# EAGLE design HighVBoard_01 (EAGLE 9.3.2)
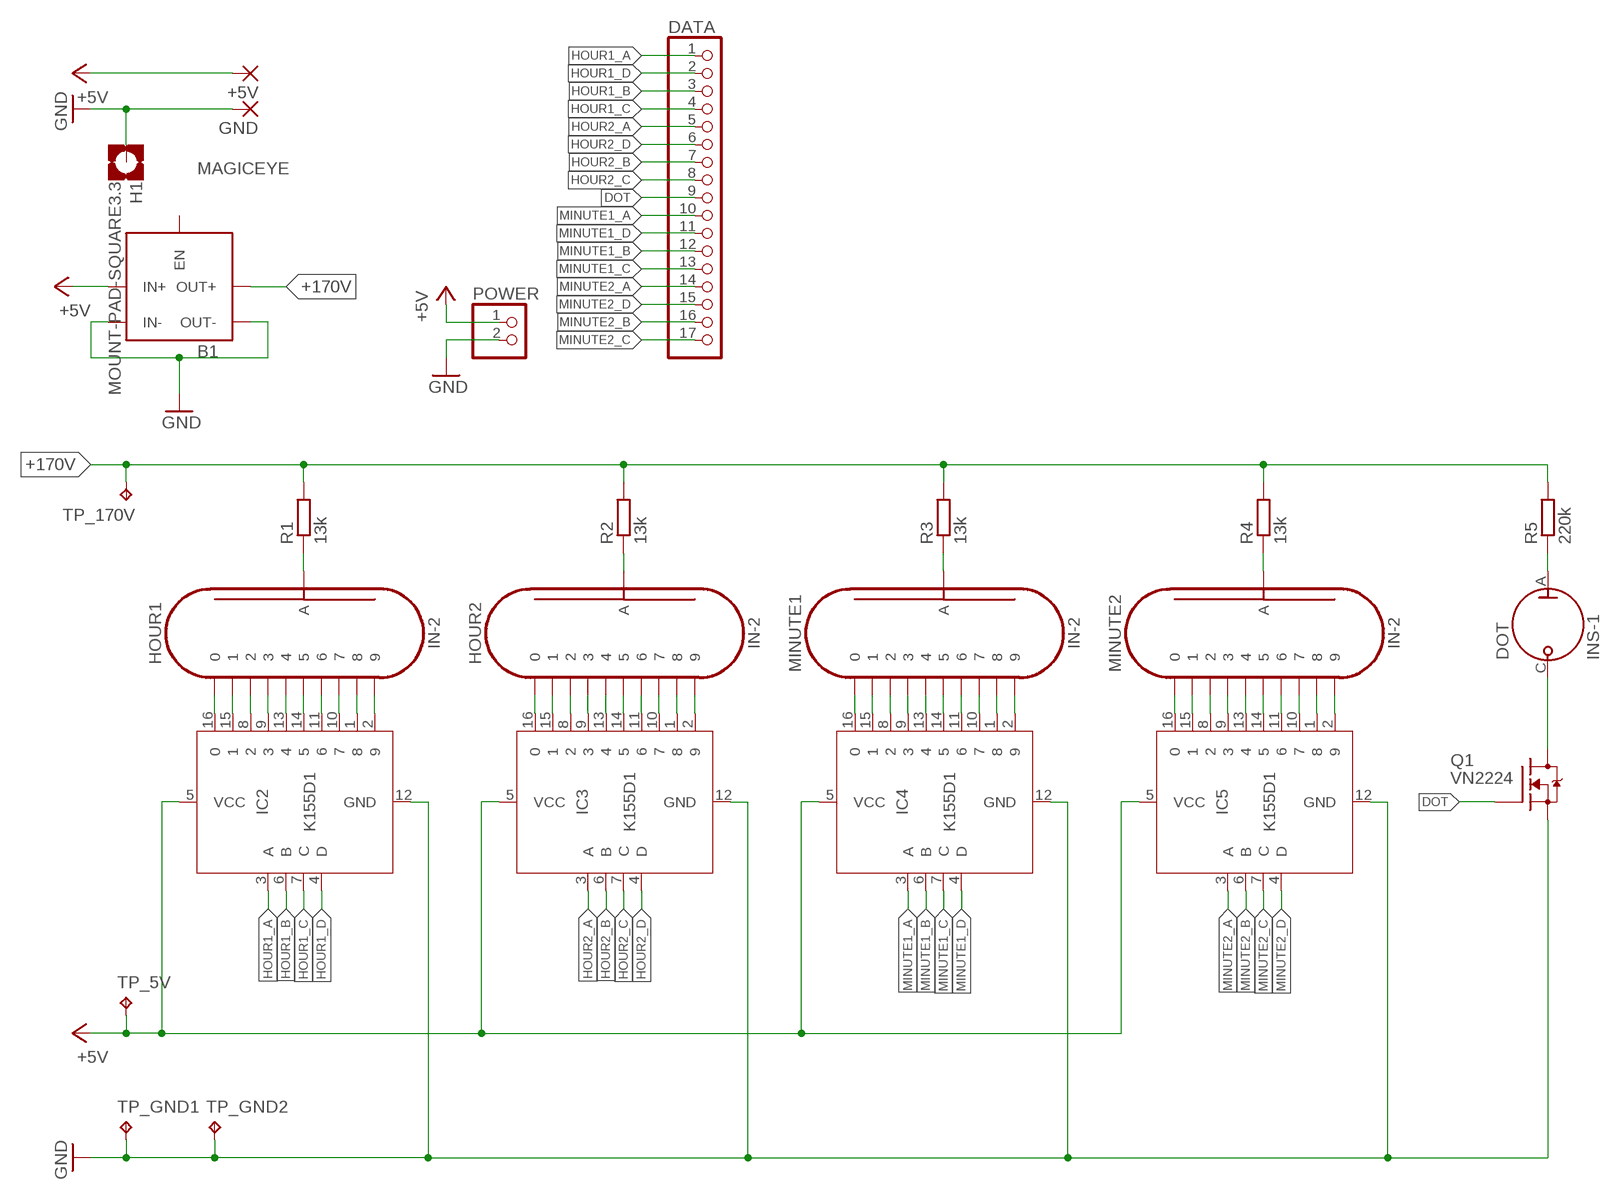
[diagram p0: schematic, sheet 1]

## Parts
+5V  2,15/1,0  [2,15/1,0]
B1  MAGICEYE  [MAGICEYE]
DATA  PINHD-1X17  [1X17]
DOT  INS-1  [INS-1]
GND  2,15/1,0  [2,15/1,0]
H1  MOUNT-PAD-SQUARE3.3  [3,3-PAD-SQUARE]
HOUR1  IN-2  [IN-2]
HOUR2  IN-2  [IN-2]
IC2  K155D1  [DIL16]
IC3  K155D1  [DIL16]
IC4  K155D1  [DIL16]
IC5  K155D1  [DIL16]
MINUTE1  IN-2  [IN-2]
MINUTE2  IN-2  [IN-2]
POWER  PINHD-1X2  [1X02]
Q1  VN2224  [TO92]
R1  13k  R-EU_0207/10  [0207/10]
R2  13k  R-EU_0207/10  [0207/10]
R3  13k  R-EU_0207/10  [0207/10]
R4  13k  R-EU_0207/10  [0207/10]
R5  220k  R-EU_0207/10  [0207/10]
TP_5V  TPPAD1-13  [P1-13]
TP_170V  TPPAD1-13  [P1-13]
TP_GND1  TPPAD1-13  [P1-13]
TP_GND2  TPPAD1-13  [P1-13]

## Nets
+5V [+5V]: +5V.1(P) B1.IN+ IC2.5(VCC) IC3.5(VCC) IC4.5(VCC) IC5.5(VCC) POWER.1 TP_5V.TP
+170V [+170V]: B1.OUT+ R1.2 R2.2 R3.2 R4.2 R5.2 TP_170V.TP
DOT: DATA.9 Q1.2(G)
GND [GND]: B1.IN- B1.OUT- GND.1(P) H1.B3,3(MOUNT) IC2.12(GND) IC3.12(GND) IC4.12(GND) IC5.12(GND) POWER.2 Q1.1(S) TP_GND1.TP TP_GND2.TP
HOUR1_A: DATA.1 IC2.3(A)
HOUR1_B: DATA.3 IC2.6(B)
HOUR1_C: DATA.4 IC2.7(C)
HOUR1_D: DATA.2 IC2.4(D)
HOUR2_A: DATA.5 IC3.3(A)
HOUR2_B: DATA.7 IC3.6(B)
HOUR2_C: DATA.8 IC3.7(C)
HOUR2_D: DATA.6 IC3.4(D)
MINUTE1_A: DATA.10 IC4.3(A)
MINUTE1_B: DATA.12 IC4.6(B)
MINUTE1_C: DATA.13 IC4.7(C)
MINUTE1_D: DATA.11 IC4.4(D)
MINUTE2_A: DATA.14 IC5.3(A)
MINUTE2_B: DATA.16 IC5.6(B)
MINUTE2_C: DATA.17 IC5.7(C)
MINUTE2_D: DATA.15 IC5.4(D)
N$1: DOT.C Q1.3(D)
N$7: HOUR1.0 IC2.16
N$10 [+170V]: HOUR1.1 IC2.15
N$11 [+170V]: HOUR1.2 IC2.8
N$12 [+170V]: HOUR1.3 IC2.9
N$13 [+170V]: HOUR1.4 IC2.13
N$14 [+170V]: HOUR1.5 IC2.14
N$15 [+170V]: HOUR1.6 IC2.11
N$16 [+170V]: HOUR1.7 IC2.10
N$17 [+170V]: HOUR1.8 IC2.1
N$18 [+170V]: HOUR1.9 IC2.2
N$19 [+170V]: HOUR1.A R1.1
N$20 [+170V]: HOUR2.0 IC3.16
N$21 [+170V]: HOUR2.1 IC3.15
N$22 [+170V]: HOUR2.2 IC3.8
N$23 [+170V]: HOUR2.3 IC3.9
N$24 [+170V]: HOUR2.4 IC3.13
N$25 [+170V]: HOUR2.5 IC3.14
N$26 [+170V]: HOUR2.6 IC3.11
N$27 [+170V]: HOUR2.7 IC3.10
N$28 [+170V]: HOUR2.8 IC3.1
N$29 [+170V]: HOUR2.9 IC3.2
N$30 [+170V]: HOUR2.A R2.1
N$31 [+170V]: IC4.16 MINUTE1.0
N$32 [+170V]: IC4.15 MINUTE1.1
N$33 [+170V]: IC4.8 MINUTE1.2
N$34 [+170V]: IC4.9 MINUTE1.3
N$35 [+170V]: IC4.13 MINUTE1.4
N$36 [+170V]: IC4.14 MINUTE1.5
N$37 [+170V]: IC4.11 MINUTE1.6
N$38 [+170V]: IC4.10 MINUTE1.7
N$39 [+170V]: IC4.1 MINUTE1.8
N$40 [+170V]: IC4.2 MINUTE1.9
N$41 [+170V]: MINUTE1.A R3.1
N$42 [+170V]: IC5.16 MINUTE2.0
N$43 [+170V]: IC5.15 MINUTE2.1
N$44 [+170V]: IC5.8 MINUTE2.2
N$45 [+170V]: IC5.9 MINUTE2.3
N$46 [+170V]: IC5.13 MINUTE2.4
N$47 [+170V]: IC5.14 MINUTE2.5
N$48 [+170V]: IC5.11 MINUTE2.6
N$49 [+170V]: IC5.10 MINUTE2.7
N$50 [+170V]: IC5.1 MINUTE2.8
N$51 [+170V]: IC5.2 MINUTE2.9
N$52 [+170V]: MINUTE2.A R4.1
N$55 [+170V]: DOT.A R5.1
Unconnected: B1.EN

## Library data of the parts
+5V GND = wirepad:2,15/1,0: THROUGH-HOLE PAD
B1 = Nixie:MAGICEYE
DATA = pinhead:PINHD-1X17: PIN HEADER
DOT = Nixie:INS-1
H1 = holes:MOUNT-PAD-SQUARE: MOUNTING PAD, square
HOUR1 HOUR2 MINUTE1 MINUTE2 = Nixie:IN-2
IC2-IC5 = Nixie:K155D1
POWER = pinhead:PINHD-1X2: PIN HEADER
Q1 = Nixie:VN2224
R1-R5 = resistor:R-EU_: RESISTOR, European symbol
TP_5V TP_170V TP_GND1 TP_GND2 = testpad:TP: Test pad

## Net classes
0 SIGNAL: width 0.203 mm, clearance 0.203 mm
2 +5V: width 0.406 mm, clearance 0.203 mm
3 +170V: width 0.203 mm, clearance 0.406 mm
4 GND: clearance 0.203 mm

## Board
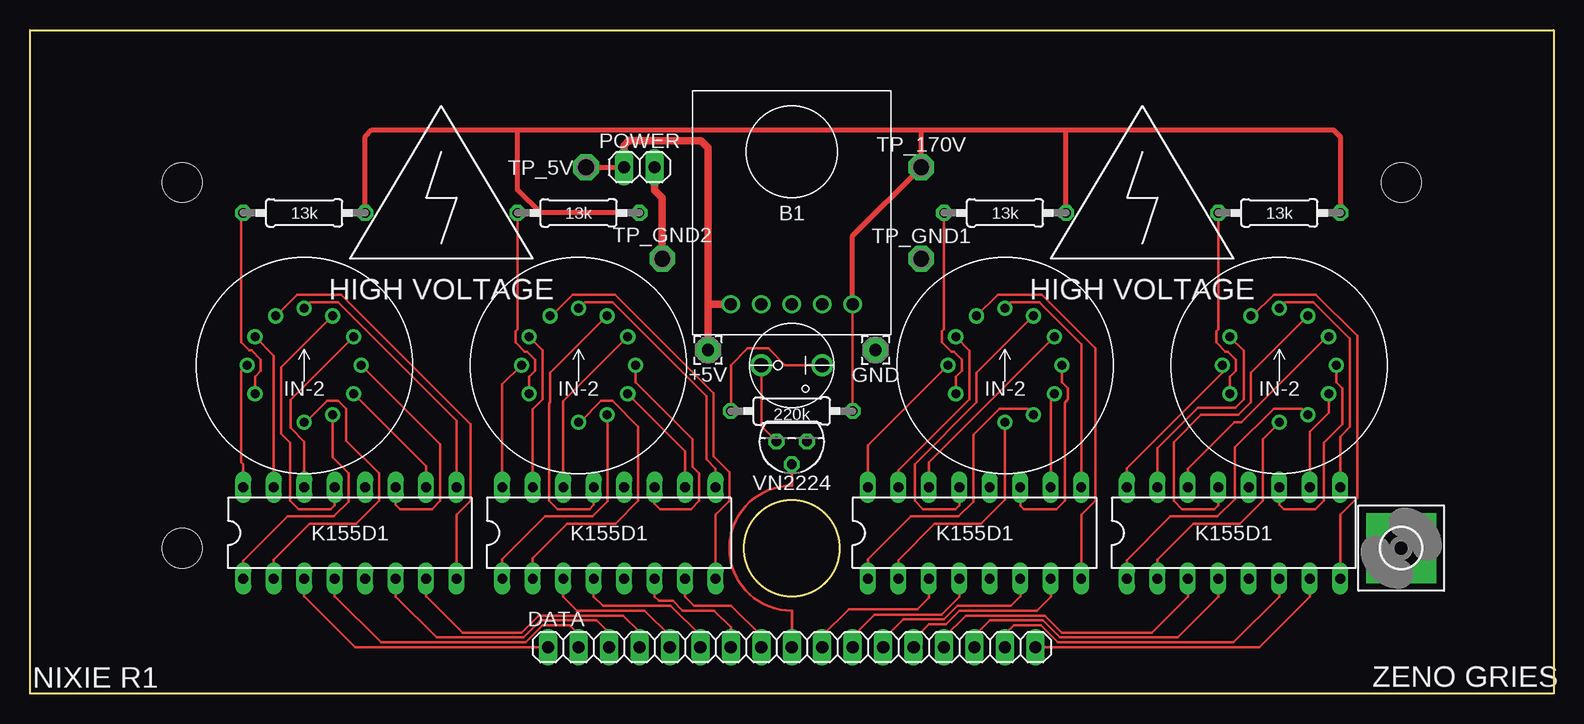
[diagram p1: board, top side]
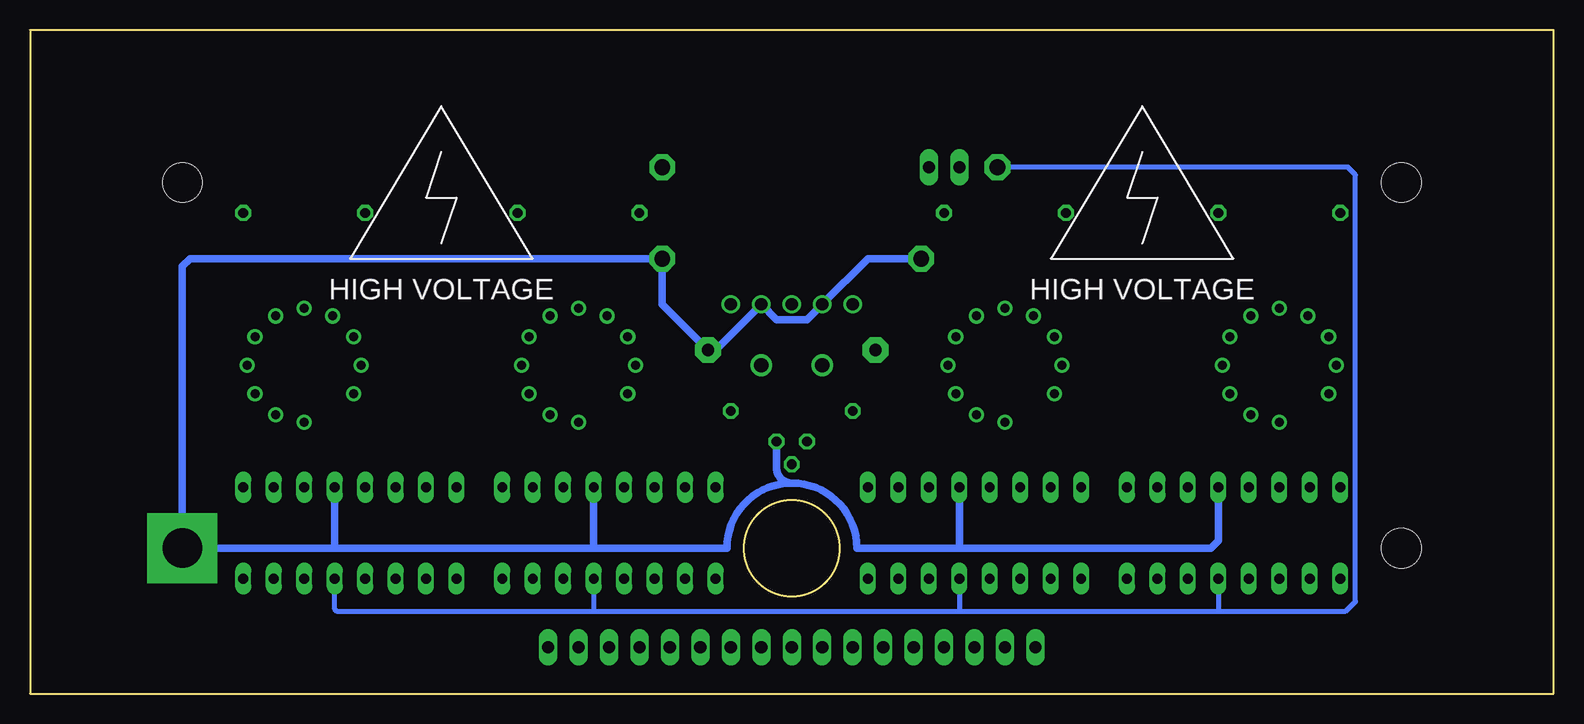
[diagram p2: board, bottom side, seen from below]

Size 127 x 55.31 mm. Coordinates in mm from the lower left corner, seen from the top.
Outline: 0,0 0,55.31 127,55.31 127,0 0,0
Outline: circle at 63.5,12.13 radius 4
Copper layers (1*16): Top 0.035mm / dielectric 1.5mm / Bottom 0.035mm
Design rules "default *": minimum track width 6mil, minimum drill 0.35mm, track to track 8mil, track to pad 8mil, pad to pad 8mil, via to via 8mil, smd to smd 6mil, copper to edge 40mil, drill to drill 6mil, minimum pad ring 10mil, minimum via ring 8mil, stop-mask expansion 4mil, vias tented up to drill 0mil, thermal gap 10mil
Holes 3.3 mm at 12.7,42.61 12.7,12.13 114.3,42.61

### Footprints (pad centres in the part's own frame; a part is rotated, then mirrored left to right if it is on the bottom)
2,15/1,0 = drill 1.016 pad 2.159 octagon: 1 0,0
MAGICEYE = drill 1.016: EN 0,0; IN+ -5.08,0; IN- -2.54,0; OUT+ 5.08,0; OUT- 2.54,0
1X17 = drill 1.016 long: 1 -20.32,0; 2 -17.78,0; 3 -15.24,0; 4 -12.7,0; 5 -10.16,0; 6 -7.62,0; 7 -5.08,0; 8 -2.54,0; 9 0,0; 10 2.54,0; 11 5.08,0; 12 7.62,0; 13 10.16,0; 14 12.7,0; 15 15.24,0; 16 17.78,0; 17 20.32,0
INS-1 = drill 1.2: A 0,2.54; C 0,-2.54
3,3-PAD-SQUARE = drill 3.3 pad 5.842 square: B3,3 0,0
IN-2 = drill 0.75: 0 -4.75,0; 1 -4.11,2.375; 2 -2.375,4.11; 3 0,4.75; 4 2.375,4.11; 5 4.11,2.375; 6 4.75,0; 7 4.11,-2.375; 8 2.375,-4.11; 9 0,-4.75; A -4.11,-2.375
DIL16 = drill 0.813 long: 1 -8.89,-3.81; 2 -6.35,-3.81; 3 -3.81,-3.81; 4 -1.27,-3.81; 5 1.27,-3.81; 6 3.81,-3.81; 7 6.35,-3.81; 8 8.89,-3.81; 9 8.89,3.81; 10 6.35,3.81; 11 3.81,3.81; 12 1.27,3.81; 13 -1.27,3.81; 14 -3.81,3.81; 15 -6.35,3.81; 16 -8.89,3.81
1X02 = drill 1.016 long: 1 -1.27,0; 2 1.27,0
TO92 = drill 0.813 octagon: 1 -1.27,0; 2 0,1.905; 3 1.27,0
0207/10 = drill 0.813 octagon: 1 -5.08,0; 2 5.08,0
P1-13 = drill 1.321 pad 2.159 octagon: TP 0,0

### Placement (x,y rotation side)
+5V  56.52,28.64 0 top
B1  63.5,32.45 0 top
DATA  63.5,3.88 0 top
DOT  63.5,27.37 270 top
GND  70.48,28.64 0 top
H1  114.3,12.13 0 top
HOUR1  22.86,27.37 0 top
HOUR2  45.72,27.37 0 top
IC2  26.67,13.4 0 top
IC3  48.26,13.4 0 top
IC4  78.74,13.4 0 top
IC5  100.33,13.4 0 top
MINUTE1  81.28,27.37 0 top
MINUTE2  104.14,27.37 0 top
POWER  50.8,43.88 0 top
Q1  63.5,21.02 180 top
R1  22.86,40.07 0 top
R2  45.72,40.07 0 top
R3  81.28,40.07 0 top
R4  104.14,40.07 0 top
R5  63.5,23.56 0 top
TP_5V  46.35,43.88 0 top
TP_170V  74.3,43.88 0 top
TP_GND1  74.3,36.26 0 top
TP_GND2  52.7,36.26 0 top

### Tracks (layer width: path | path; a pad name or v marks a point on that pad's centre or on a via)
+5V
  Top 0.406: TP_5V.TP POWER.1
  Top 0.61: POWER.1 49.53,45.68 49.91,46.06 55.93,46.06 56.52,45.48 56.52,32.45 | +5V.1 56.52,32.45 | B1.IN+ 56.52,32.45
  Bottom 0.406: TP_5V.TP 17.14,43.88 16.51,43.24 16.51,7.69 17.36,6.83 27.94,6.83 | IC5.5 101.6,7.05 101.39,6.83 80.01,6.83 | 27.94,6.83 49.53,6.83 | 49.53,6.83 80.01,6.83 | IC4.5 80.01,6.83 | IC3.5 49.53,6.83 | IC2.5 27.94,6.83
+170V
  Top 0.203: R5.2 B1.OUT+
  Top 0.406: R1.2 27.94,46.42 28.5,46.98 40.66,46.98 | 40.66,46.98 74.3,46.98 | 74.3,46.98 86.36,46.98 | 86.36,46.98 108.66,46.98 109.22,46.42 R4.2 | R2.2 42.55,40.07 40.66,41.95 40.66,46.98 | 74.3,46.98 TP_170V.TP 68.58,38.16 B1.OUT+ | R3.2 86.36,46.98
DOT
  Top 0.203: DATA.9 63.5,6.92 arc-90 58.29,12.13 arc-90 63.5,17.34 Q1.2
GND
  Top 0.61: POWER.2 52.07,41.98 52.7,41.34 TP_GND2.TP
  Bottom 0.61: 101.6,12.13 H1.B3,3 114.3,35.62 113.67,36.26 TP_GND1.TP 74.3,32.45 GND.1 69.85,28.64 B1.OUT- 64.76,31.18 62.21,31.18 60.96,32.43 B1.IN- 57.15,36.26 TP_GND2.TP | 101.6,12.13 80.01,12.13 | 80.01,12.13 68.91,12.13 arc90 63.49,17.55 | IC5.12 101.6,12.13 | IC4.12 80.01,12.13 | 63.49,17.55 arc90 58.06,12.13 49.53,12.13 | 49.53,12.13 28.57,12.13 27.94,12.77 IC2.12 | Q1.1 64.77,18.84 arc-90 63.49,17.55 | IC3.12 49.53,12.13
HOUR1_A
  Top 0.203: DATA.1 27.1,3.88 22.86,8.12 IC2.3
HOUR1_B
  Top 0.203: IC2.6 30.48,8.09 33.88,4.69 41.15,4.69 42.57,6.11 47.24,6.11 48.26,5.09 DATA.3
HOUR1_C
  Top 0.203: IC2.7 33.02,8.14 36.07,5.09 40.98,5.09 42.4,6.52 49.43,6.52 50.8,5.14 DATA.4
HOUR1_D
  Top 0.203: IC2.4 25.4,8.14 29.26,4.28 41.32,4.28 42.74,5.7 44.97,5.7 45.72,4.95 DATA.2
HOUR2_A
  Top 0.203: IC3.3 44.45,8.07 45.59,6.92 51.23,6.92 53.34,4.81 DATA.5
HOUR2_B
  Top 0.203: IC3.6 52.07,8.09 52.43,7.74 53.59,7.74 54.4,6.92 57.02,6.92 58.42,5.53 DATA.7
HOUR2_C
  Top 0.203: IC3.7 54.61,8.09 55.37,7.33 58.45,7.33 60.96,4.82 DATA.8
HOUR2_D
  Top 0.203: IC3.4 46.99,8.09 47.75,7.33 53.42,7.33 55.88,4.87 DATA.6
MINUTE1_A
  Top 0.203: DATA.10 66.04,4.81 68.28,7.05 73.99,7.05 74.93,7.99 IC4.3
MINUTE1_B
  Top 0.203: IC4.6 82.55,8.12 81.76,7.33 77.31,7.33 76.17,6.19 72.8,6.19 71.12,4.51 DATA.12
MINUTE1_C
  Top 0.203: IC4.7 85.09,8.07 83.95,6.92 77.48,6.92 76.34,5.78 74.93,5.78 73.66,4.51 DATA.13
MINUTE1_D
  Top 0.203: DATA.11 68.58,4.76 70.41,6.59 76,6.59 77.47,8.07 IC4.4
MINUTE2_A
  Top 0.203: IC5.3 96.52,8.09 93.52,5.09 86.02,5.09 84.6,6.52 78.03,6.52 76.2,4.69 DATA.14
MINUTE2_B
  Top 0.203: IC5.6 104.14,8.09 100.33,4.28 85.68,4.28 84.26,5.7 82.01,5.7 81.28,4.98 DATA.16
MINUTE2_C
  Top 0.203: IC5.7 106.68,8.07 102.49,3.88 DATA.17
MINUTE2_D
  Top 0.203: IC5.4 99.06,8.07 95.68,4.69 85.85,4.69 84.43,6.11 80.03,6.11 78.74,4.81 DATA.15
N$1
  Top 0.203: DOT.C 60.96,22.29 Q1.3
N$7
  Top 0.203: IC2.16 17.78,19.11 17.6,19.29 17.6,26.86 HOUR1.0
N$10
  Top 0.203: IC2.15 20.32,28.18 HOUR1.1
N$11
  Top 0.203: IC2.8 35.56,14.9 36.73,16.07 36.73,22.46 25.93,33.26 22.29,33.26 20.51,31.48 HOUR1.2
N$12
  Top 0.203: HOUR1.3 23.37,32.62 25.71,32.62 35.56,22.76 IC2.9
N$13
  Top 0.203: HOUR1.4 20.95,27.2 20.95,21.66 21.69,20.92 21.69,16.07 22.38,15.38 25.07,15.38 25.4,15.71 IC2.13
N$14
  Top 0.203: IC2.14 22.86,21.01 21.72,22.15 21.72,24.5 HOUR1.5
N$15
  Top 0.203: HOUR1.6 34.19,20.79 34.19,16.07 33.5,15.38 30.86,15.38 30.48,15.76 IC2.11
N$16
  Top 0.203: HOUR1.7 33.02,18.95 IC2.10
N$17
  Top 0.203: HOUR1.8 25.23,19.69 26.57,18.35 26.57,16.02 25.32,14.77 21.46,14.77 17.78,11.09 IC2.1
N$18
  Top 0.203: HOUR1.9 22.99,22.62 24.76,24.4 25.71,24.4 26.37,23.73 26.37,21.09 29.11,18.35 29.11,16.07 27.2,14.16 23.32,14.16 20.32,11.16 IC2.2
N$19
  Top 0.203: HOUR1.A 18.75,26.4 19.25,26.9 19.25,27.84 18.48,28.61 18.28,28.61 17.61,29.27 17.61,39.9 R1.1
N$20
  Top 0.203: HOUR2.0 39.37,25.77 IC3.16
N$21
  Top 0.203: IC3.15 41.91,23.69 42.75,24.52 42.75,28.61 HOUR2.1
N$22
  Top 0.203: IC3.8 57.15,14.9 58.32,16.07 58.32,18.46 57,19.78 57,25.05 48.79,33.26 45.25,33.26 43.47,31.48 HOUR2.2
N$23
  Top 0.203: HOUR2.3 45.76,32.12 46.25,32.62 48.57,32.62 56.39,24.79 56.39,19.52 57.15,18.76 IC3.9
N$24
  Top 0.203: HOUR2.4 43.36,26.74 43.36,24.27 43.28,24.2 43.28,16.07 43.97,15.38 46.64,15.38 46.99,15.73 IC3.13
N$25
  Top 0.203: IC3.14 44.45,24.36 HOUR2.5
N$26
  Top 0.203: HOUR2.6 50.47,25.96 55.22,21.21 55.22,18.91 55.78,18.35 55.78,16.07 55.09,15.38 52.5,15.38 52.07,15.81 IC3.11
N$27
  Top 0.203: IC3.10 54.61,20.21 HOUR2.7
N$28
  Top 0.203: IC3.1 39.37,11.19 42.95,14.77 46.89,14.77 48.16,16.04 48.16,23.2 HOUR2.8
N$29
  Top 0.203: HOUR2.9 45.85,22.62 47.62,24.4 48.57,24.4 50.7,22.27 50.7,16.07 48.8,14.16 44.78,14.16 41.91,11.29 IC3.2
N$30
  Top 0.203: R2.1 40.64,30.38 40.47,30.22 40.47,29.27 41.24,28.51 41.44,28.51 42.11,27.84 42.11,26.9 41.62,26.41 41.62,25.01 HOUR2.A
N$31
  Top 0.203: IC4.16 69.85,20.69 MINUTE1.0
N$32
  Top 0.203: IC4.15 72.39,18.61 78.31,24.52 78.31,28.6 77.17,29.73 MINUTE1.1
N$33
  Top 0.203: IC4.8 87.63,14.9 88.8,16.07 88.8,28.81 84.35,33.26 80.68,33.26 MINUTE1.2 | MINUTE1.2
N$34
  Top 0.203: IC4.9 87.63,29.11 84.13,32.62 81.76,32.62 81.28,32.13 MINUTE1.3
N$35
  Top 0.203: MINUTE1.4 78.92,26.74 78.92,24.27 73.76,19.12 73.76,16.07 74.45,15.38 77.14,15.38 77.47,15.71 IC4.13
N$36
  Top 0.203: IC4.14 74.93,19.29 MINUTE1.5
N$37
  Top 0.203: MINUTE1.6 86.03,25.96 86.53,25.47 86.53,24.52 86.26,24.25 86.26,16.07 85.57,15.38 82.85,15.38 82.55,15.68 IC4.11
N$38
  Top 0.203: IC4.10 85.09,24.7 MINUTE1.7
N$39
  Top 0.203: MINUTE1.8 83.64,23.26 83.15,23.76 80.81,23.76 78.64,21.59 78.64,16.02 77.39,14.77 73.43,14.77 69.85,11.19 IC4.1
N$40
  Top 0.203: MINUTE1.9 81.28,16.17 79.28,14.16 75.41,14.16 72.39,11.14 IC4.2
N$41
  Top 0.203: R3.1 76.2,30.38 76.03,30.22 76.03,29.27 76.8,28.51 77,28.51 77.67,27.84 77.67,26.9 77.19,26.42 77.19,25.02 MINUTE1.A
N$42
  Top 0.203: IC5.16 91.44,18.79 99.39,26.73 MINUTE2.0
N$43
  Top 0.203: MINUTE2.1 100.03,29.71 101.17,28.57 101.17,24.52 100.48,23.84 97.36,23.84 93.98,20.46 IC5.15
N$44
  Top 0.203: IC5.8 109.22,14.9 110.64,16.31 110.64,29.83 107.21,33.26 103.67,33.26 101.89,31.48 MINUTE2.2
N$45
  Top 0.203: IC5.9 109.22,21.43 110.03,22.23 110.03,29.58 106.99,32.62 104.65,32.62 MINUTE2.3
N$46
  Top 0.203: MINUTE2.4 101.78,26.74 101.78,24.27 100.73,23.23 97.61,23.23 95.35,20.97 95.35,16.07 96.04,15.38 98.73,15.38 99.06,15.71 IC5.13
N$47
  Top 0.203: IC5.14 96.52,18.73 100.41,22.62 100.99,22.62 108.11,29.75 MINUTE2.5
N$48
  Top 0.203: MINUTE2.6 108.89,25.96 109.39,25.47 109.39,22.46 107.85,20.92 107.85,16.07 107.16,15.38 104.52,15.38 104.14,15.76 IC5.11
N$49
  Top 0.203: IC5.10 106.68,21.82 108.26,23.4 108.26,24.98 MINUTE2.7
N$50
  Top 0.203: IC5.1 91.44,11.14 95.07,14.77 98.98,14.77 100.43,16.22 100.43,20.52 103.67,23.76 106.01,23.76 MINUTE2.8
N$51
  Top 0.203: MINUTE2.9 104.14,22.57 102.77,21.2 102.77,16.07 100.86,14.16 96.98,14.16 93.98,11.16 IC5.2
N$52
  Top 0.203: R4.1 99.06,30.38 98.89,30.22 98.89,29.27 99.66,28.51 99.86,28.51 100.53,27.84 100.53,26.9 100.03,26.4 MINUTE2.A
N$55
  Top 0.203: R5.1 58.42,27.37 59.83,28.78 61.54,28.78 62.95,27.37 DOT.A

### Text on the board
tPlace: HIGH VOLTAGE | HIGH VOLTAGE
bPlace: HIGH VOLTAGE | HIGH VOLTAGE
tNames: NIXIE R1 | ZENO GRIES